# EAGLE design Adaptor485mini (EAGLE 6.5.0)
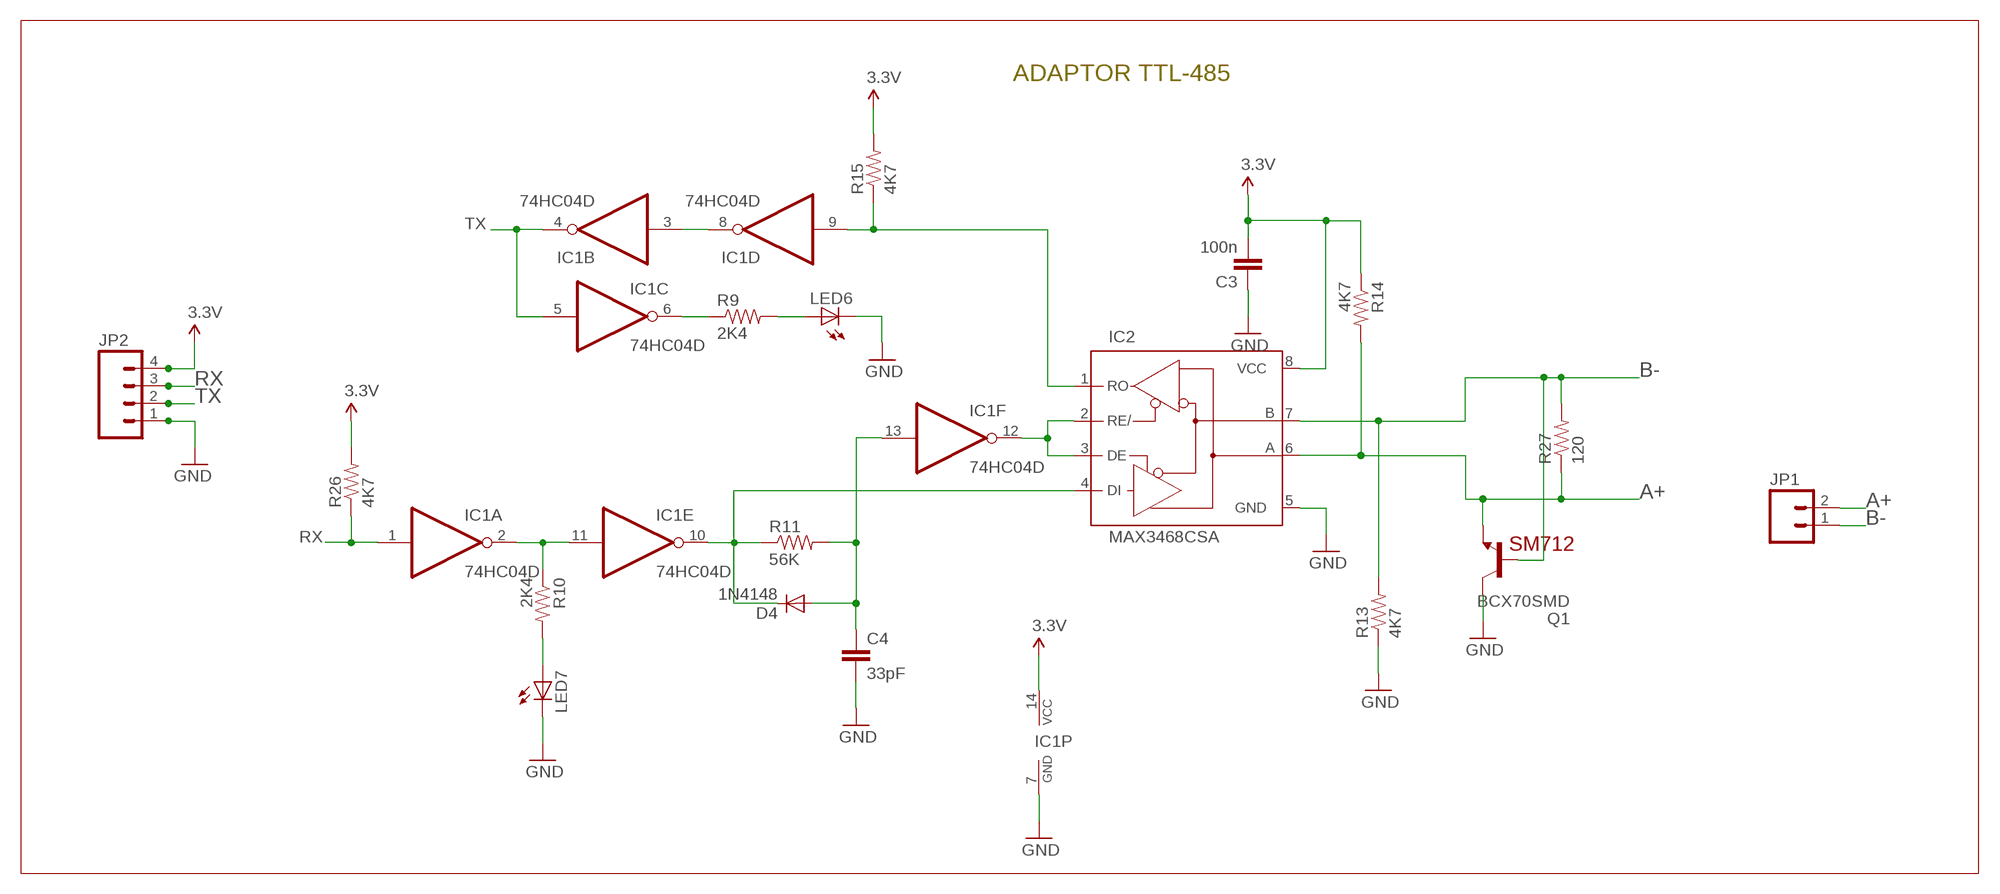
[diagram p0: schematic, sheet 1]

## Parts
C3  100n  CAP0805  [0805]
C4  33pF  CAP0805  [0805]
D4  1N4148  DIODE-MINIMELF  [MINIMELF]
IC1  74HC04D  [SO14]
IC2  MAX3468CSA  [SO08]
JP1  M02PTH  [1X02]
JP2  M04PTH  [1X04]
LED6  LEDCHIP-LED0805  [CHIP-LED0805]
LED7  LEDCHIP-LED0805  [CHIP-LED0805]
Q1  BCX70SMD  [SOT23]
R9  2K4  RESISTOR0805-RES  [0805]
R10  2K4  RESISTOR0805-RES  [0805]
R11  56K  RESISTOR0805-RES  [0805]
R13  4K7  RESISTOR0805-RES  [0805]
R14  4K7  RESISTOR0805-RES  [0805]
R15  4K7  RESISTOR0805-RES  [0805]
R26  4K7  RESISTOR0805-RES  [0805]
R27  120  RESISTOR0805-RES  [0805]

## Nets
3.3V: C3.2 IC1.14(P:VCC) IC2.8(VCC) JP2.4 R14.1 R15.2 R26.2
A+: IC2.6(A) JP1.2 Q1.2(E) R14.2 R27.1
B-: IC2.7(B) JP1.1 Q1.1(B) R13.2 R27.2
GND: C3.1 C4.2 IC1.7(P:GND) IC2.5(GND) JP2.1 LED6.C LED7.C Q1.3(C) R13.1
N$16: LED7.A R10.2
N$17: LED6.A R9.2
N$19: IC1.2(A:O) IC1.11(E:I) R10.1
N$21: IC1.9(D:I) IC2.1(RO) R15.1
N$23: IC1.3(B:I) IC1.8(D:O)
N$24: C4.1 D4.A IC1.13(F:I) R11.2
N$27: IC1.6(C:O) R9.1
N$29: D4.C IC1.10(E:O) IC2.4(DI) R11.1
N$30: IC1.12(F:O) IC2.2(RE/) IC2.3(DE)
RX: IC1.1(A:I) JP2.3 R26.1
TX: IC1.4(B:O) IC1.5(C:I) JP2.2

## Notes on the sheet
- ADAPTOR TTL-485
- SM712

## Library data of the parts
C3 C4 = SparkFun-Passives:CAP: Capacitor Standard 0603 ceramic capacitor, and 0.1" leaded capacitor.
D4 = diode:DIODE-: DIODE
IC1 = 74xx-eu:74*04: Hex INVERTER
IC2 = maxim:MAX34*: +5V, Fail-Safe, 40Mbps, Profibus RS-485/RS-422 Transceivers Source: MAX3465-MAX3469.pdf; MPN: MAX3468CSA+; OC_FARNELL: unknown; OC_NEWARK: 76K6721
JP1 = SparkFun-Connectors:M02: Header 2 Standard 2-pin 0.1" header. Use with straight break away headers (SKU : PRT-00116), right angle break away headers (PRT-00553), swiss pins (PRT-00743), machine pins (PRT-00117), and female headers (PRT-00115). Molex polarized connector foot print use with SKU : PRT-08233 with associated crimp pins and housings.
JP2 = SparkFun-Connectors:M04: Header 4 Standard 4-pin 0.1" header. Use with straight break away headers (SKU : PRT-00116), right angle break away headers (PRT-00553), swiss pins (PRT-00743), machine pins (PRT-00117), and female headers (PRT-00115). Molex polarized connector foot print use with SKU : PRT-08231 with associated crimp pins and housings. 1MM SMD Version SKU: PRT-10208
LED6 LED7 = led:LED: LED OSRAM: - CHIPLED LG R971, LG N971, LY N971, LG Q971, LY Q971, LO R971, LY R971 LH N974, LH R974 LS Q976, LO Q976, LY Q976 LO Q996 - Hyper CHIPLED LW Q18S LB Q993, LB Q99A, LB R99A - SideLED LS A670, LO A670, LY A670, LG A670, LP A670 LB A673, LV A673, LT A673, LW A673 LH A674 LY A675 LS A676, LA A676, LO A676, LY A676, LW A676 LS A679, LY A679, LG A679 - Hyper Micro SIDELED® LS Y876, LA Y876, LO Y876, LY Y876 LT Y87S - SmartLED LW L88C, LW L88S LB L89C, LB L89S, LG L890 LS L89K, LO L89K, LY L89K LS L896, LA L896, LO L896, LY L896 - TOPLED LS T670, LO T670, LY T670, LG T670, LP T670 LSG T670, LSP T670, LSY T670, LOP T670, LYG T670 LG T671, LOG T671, LSG T671 LB T673, LV T673, LT T673, LW T673 LH T674 LS T676, LA T676, LO T676, LY T676, LB T676, LH T676, LSB T676, LW T676 LB T67C, LV T67C, LT T67C, LS T67K, LO T67K, LY T67K, LW E67C LS E67B, LA E67B, LO E67B, LY E67B, LB E67C, LV E67C, LT E67C LW T67C LS T679, LY T679, LG T679 LS T770, LO T770, LY T770, LG T770, LP T770 LB T773, LV T773, LT T773, LW T773 LH T774 LS E675, LA E675, LY E675, LS T675 LS T776, LA T776, LO T776, LY T776, LB T776 LHGB T686 LT T68C, LB T68C - Hyper Mini TOPLED® LB M676 - Mini TOPLED Santana® LG M470 LS M47K, LO M47K, LY M47K Source: http://www.osram.convergy.de LUXEON: - LUMILED® LXK2-PW12-R00, LXK2-PW12-S00, LXK2-PW14-U00, LXK2-PW14-V00 LXK2-PM12-R00, LXK2-PM12-S00, LXK2-PM14-U00 LXK2-PE12-Q00, LXK2-PE12-R00, LXK2-PE12-S00, LXK2-PE14-T00, LXK2-PE14-U00 LXK2-PB12-K00, LXK2-PB12-L00, LXK2-PB12-M00, LXK2-PB14-N00, LXK2-PB14-P00, LXK2-PB14-Q00 LXK2-PR12-L00, LXK2-PR12-M00, LXK2-PR14-Q00, LXK2-PR14-R00 LXK2-PD12-Q00, LXK2-PD12-R00, LXK2-PD12-S00 LXK2-PH12-R00, LXK2-PH12-S00 LXK2-PL12-P00, LXK2-PL12-Q00, LXK2-PL12-R00 Source: www.luxeon.com KINGBRIGHT: KA-3528ASYC Source: www.kingbright.com
Q1 = transistor-npn:BCX70*: NPN Transistor
R9-R11 R13-R15 R26 R27 = SparkFun-Passives:RESISTOR: Resistor Basic schematic elements and footprints for 0603, 1206, and PTH resistors.

## Board
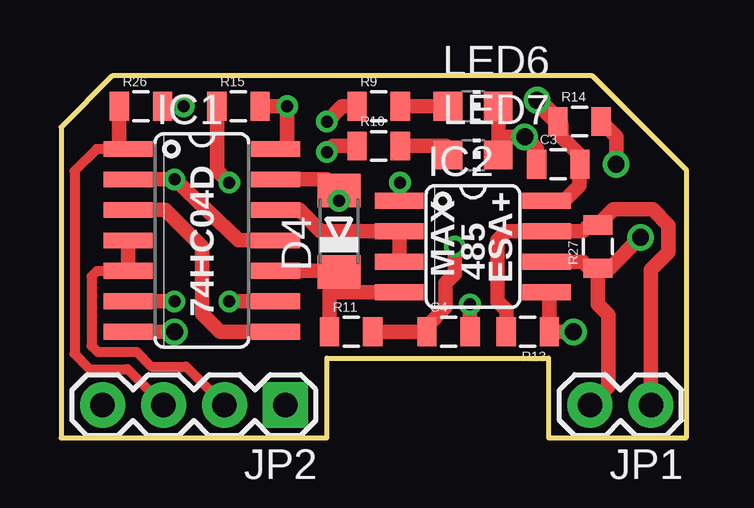
[diagram p1: board, top side]
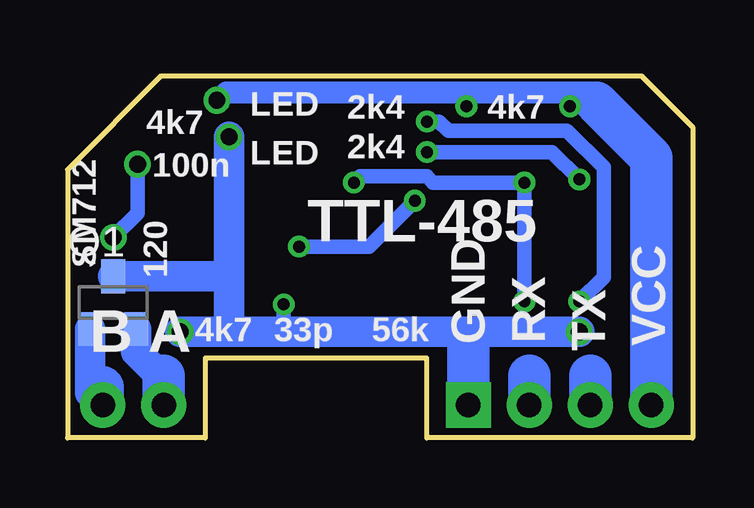
[diagram p2: board, bottom side, seen from below]

Size 26.06 x 15.09 mm. Coordinates in mm from the lower left corner, seen from the top.
Outline: 22.15,15.09 2.13,15.09 0,12.95 0,0 11.07,0 11.07,3.33 20.32,3.33 20.32,0 26.06,0 26.06,11.18 22.15,15.09
Copper layers (1*16): Top 0.035mm / dielectric 1.5mm / Bottom 0.035mm
Design rules "default *": minimum track width 10mil, minimum drill 24mil, track to track 8mil, track to pad 8mil, pad to pad 8mil, via to via 8mil, smd to smd 8mil, copper to edge 40mil, drill to drill 8mil, minimum pad ring 10mil, minimum via ring 8mil, stop-mask expansion 4mil, vias tented up to drill 24mil, thermal gap 10mil

### Footprints (pad centres in the part's own frame; a part is rotated, then mirrored left to right if it is on the bottom)
0805 = smd 0.8 x 1.2: 1 -0.9,0; 2 0.9,0
MINIMELF = smd 1.4 x 1.8: A 1.7,0; C -1.7,0
SO14 = smd 0.66 x 2.032: 1 -3.81,-3.073; 2 -2.54,-3.073; 3 -1.27,-3.073; 4 0,-3.073; 5 1.27,-3.073; 6 2.54,-3.073; 7 3.81,-3.073; 8 3.81,3.073; 9 2.54,3.073; 10 1.27,3.073; 11 0,3.073; 12 -1.27,3.073; 13 -2.54,3.073; 14 -3.81,3.073
SO08 = smd 0.66 x 2.032: 1 -1.905,-3.073; 2 -0.635,-3.073; 3 0.635,-3.073; 4 1.905,-3.073; 5 1.905,3.073; 6 0.635,3.073; 7 -0.635,3.073; 8 -1.905,3.073
1X02 = drill 1.016 pad 1.88: 1 0,0; 2 2.54,0
1X04 = drill 1.016 pad 1.88 square: 1 0,0 | drill 1.016 pad 1.88: 2 2.54,0; 3 5.08,0; 4 7.62,0
CHIP-LED0805 = smd 1.2 x 1.2: A 0,-1.05; C 0,1.05
SOT23 = smd 1 x 1.4: 1 -0.95,-1.1; 2 0.95,-1.1; 3 0,1.1

### Placement (x,y rotation side)
C3  20.73,11.4 0 top
C4  16.15,4.42 0 top
D4  11.58,8.61 90 top
IC1  5.87,8.23 270 top
IC2  17.17,7.98 270 top
JP1  24.59,1.37 180 top
JP2  9.35,1.37 180 top
LED6  17.17,13.82 270 top
LED7  17.17,11.79 270 top
Q1  24.16,5.64 0 bottom
R9  13.23,13.82 0 top
R10  13.23,12.17 0 top
R11  12.09,4.42 0 top
R13  19.46,4.42 180 top
R14  21.62,13.18 0 top
R15  7.39,13.82 0 top
R26  3.33,13.82 0 top
R27  22.38,7.98 90 top

### Tracks (layer width: path | path; a pad name or v marks a point on that pad's centre or on a via)
3.3V  (via drill 0.5, 0.7)
  Top 0.61: R15.2 v9.42,13.82 9.42,12.04 IC1.14 | R26.2 v5.11,13.82 | IC2.8 20.98,9.88 21.61,10.52 21.61,11.39 C3.2 21.63,11.78 20.85,12.55 20.85,13.04 R14.1 20.71,13.19
  Top 0.813: 20.71,13.19 v19.84,14.07
  Bottom 0.61: v9.42,13.82 9.42,14.45 | v5.11,13.82 5.11,14.45 5.23,14.45
  Bottom 0.813: v19.84,14.07 19.46,14.45 9.42,14.45 5.23,14.45 4.17,14.45 1.73,12.01 1.73,11.68
  Bottom 1.778: JP2.4 1.73,11.68 4.01,13.97
A+  (via drill 0.7)
  Top 0.61: IC2.6 21.74,7.34 22.01,7.08 R27.1 | R27.1 22.38,5.56 22.81,5.13 22.81,2.13 JP1.2 | v24.16,8.36 22.87,7.08 R27.1 | R14.2 23.14,12.56 v23.14,11.4
  Bottom 0.61: v23.14,11.4 23.14,9.37 v24.16,8.36
  Bottom 1.27: Q1.2 23.2,3.6 22.05,2.44
  Bottom 1.778: JP1.2 22.05,2.44 22.05,2.59
B-
  Top 0.61: R13.2 18.56,5.32 18.19,5.69 18.19,8.23 18.57,8.61 IC2.7 21.74,8.61 22.01,8.88 R27.2 23.03,9.53 24.66,9.53 25.32,8.87 25.32,7.75 24.59,7.01 JP1.1
  Bottom 1.27: Q1.1 25.11,1.89 JP1.1
  Bottom 1.778: JP1.1 24.59,2.11
GND  (via drill 0.5, 0.7)
  Top 0.61: C3.1 19.83,12.05 v19.33,12.55 18.22,12.55 | LED7.C 18.22,12.55 | 18.22,12.55 LED6.C | IC2.5 20.36,6.07 R13.1 v21.36,4.42 | C4.2 v17.04,5.56 | IC1.7 v4.72,4.42
  Bottom 0.61: v17.04,5.56 C4.2 17.8,4.42
  Bottom 1.27: v4.72,4.42 9.42,4.42 | 9.42,4.42 17.8,4.42 19.33,4.42 | 19.33,4.42 v21.36,4.42 | v19.33,12.55 19.33,6.76 | 19.33,6.76 19.33,4.42 | 9.35,4.17 9.35,4.34 9.42,4.42 | Q1.3 19.35,6.74 19.33,6.76
  Bottom 1.778: JP2.1 9.35,4.17
N$16
  Top 0.406: 16.04,12.17 LED7.A
  Top 0.61: R10.2 16.04,12.17
N$17
  Top 0.61: R9.2 LED6.A
N$19  (via drill 0.5)
  Top 0.61: IC1.2 v4.72,10.77 7.39,8.23 IC1.11 | R10.1 11.33,12.17 v11.07,11.91
  Bottom 0.61: v4.72,10.77 5.87,11.91 v11.07,11.91
N$21  (via drill 0.5)
  Top 0.406: IC2.1 14.12,9.91 v14.12,10.64
  Top 0.61: IC1.9 v7.01,5.69 | v7.01,10.64 6.49,11.14 R15.1
  Bottom 0.61: v7.01,5.69 v7.01,10.64 10.82,10.64 11.07,10.9 13.87,10.9 v14.12,10.64
N$23
  Top 0.61: IC1.3 4.34,9.5 5.87,7.98 5.87,5.18 6.63,4.42 IC1.8
N$24  (via drill 0.5)
  Top 0.406: D4.A 11.5,10.01 v11.58,9.88 | C4.1 15.25,4.66
  Top 0.61: IC1.13 11.07,10.77 D4.A | R11.2 C4.1 | 15.25,4.66 16.03,5.44 16.03,6.45 16.41,6.83 v16.41,7.98
  Bottom 0.61: v11.58,9.88 13.49,7.98 v16.41,7.98
N$27  (via drill 0.5)
  Top 0.61: v4.72,5.69 IC1.6 | R9.1 11.71,13.82 v11.07,13.18
  Bottom 0.61: v11.07,13.18 10.57,13.18 10.19,12.8 5.23,12.8 3.71,11.28 3.71,6.71 v4.72,5.69
N$29
  Top 0.406: 10.74,6.96 D4.C 11.19,7.04 11.19,6.07
  Top 0.61: IC1.10 10.74,6.96 | R11.1 11.19,6.07 IC2.4
N$30
  Top 0.406: IC1.12 9.93,9.5
  Top 0.61: IC2.3 IC2.2 10.82,8.61 9.93,9.5
RX
  Top 0.406: IC1.1 2.43,12.04 1.47,12.04 0.56,11.12 0.56,3.5 1.19,2.87 2.77,2.87 JP2.3
  Top 0.61: R26.1 2.43,12.04
  Bottom 1.778: JP2.3 4.27,2.59
TX
  Top 0.406: 2.79,7.98 IC1.4 | IC1.5 1.5,6.96 1.27,6.73 1.27,3.83 1.52,3.58 3.15,3.58 3.76,2.97 5.21,2.97 JP2.2
  Top 0.61: IC1.5 IC1.4
  Bottom 1.778: JP2.2 6.81,2.59
(copper drawn outside any net)
  shapes: Bottom area x1

### Text on the board
tPlace: MAX | 485 | ESA+ | 74HC04D
bPlace: 4k7 | 2k4 | LED | 4k7 | 2k4 | SM712 | LED | 100n | TTL-485 | 120 | VCC | TX | RX | GND | 56k | 33p | 4k7 | A | B